# EAGLE design honeybee (EAGLE 7.6.0)
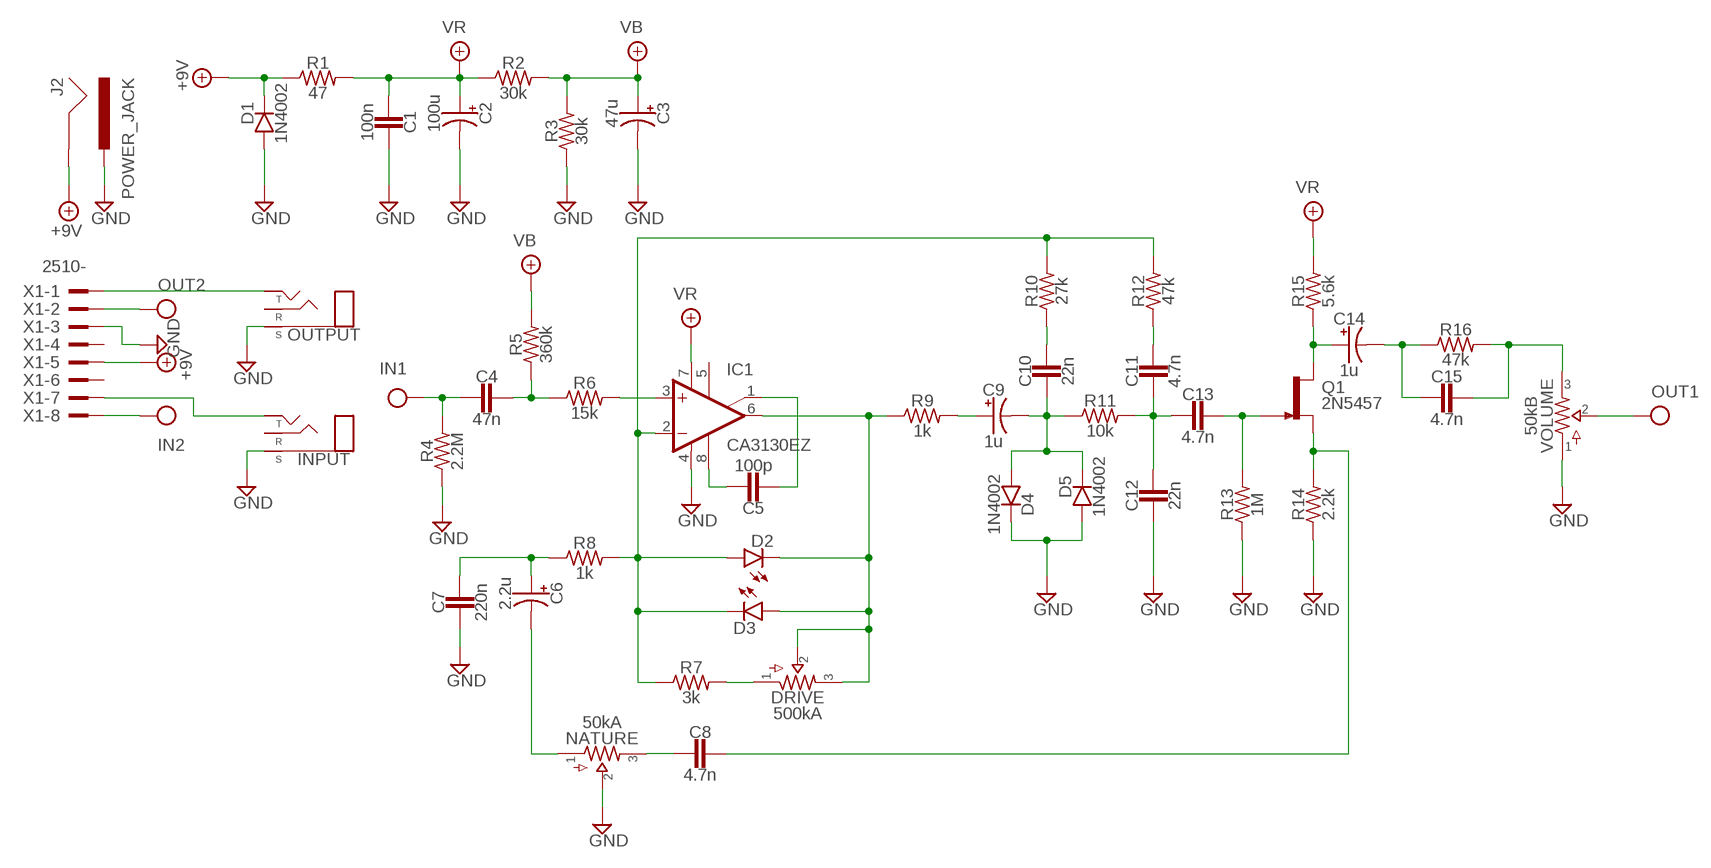
[diagram p0: schematic, sheet 1]

## Parts
C1  100n  CER/FILM2  [050X030_025_2]
C2  100u  0400  [040_020]
C3  47u  0400  [040_020]
C4  47n  CER/FILMBOX.1  [BOX_SMALL]
C5  100p  CER/FILM2  [050X030_025_2]
C6  2.2u  0500  [050_020]
C7  220n  CER/FILMBOX.1  [BOX_SMALL]
C8  4.7n  CER/FILMBOX.1  [BOX_SMALL]
C9  1u  0400  [040_020]
C10  22n  CER/FILMBOX.1  [BOX_SMALL]
C11  4.7n  CER/FILMBOX.1  [BOX_SMALL]
C12  22n  CER/FILMBOX.1  [BOX_SMALL]
C13  4.7n  CER/FILMBOX.1  [BOX_SMALL]
C14  1u  0400  [040_020]
C15  4.7n  CER/FILMBOX.1  [BOX_SMALL]
D1  1N4002  DO41.2  [DO41-2]
D2  LED  [3MM_D]
D3  LED  [3MM_D]
D4  1N4002  DO41.2  [DO41-2]
D5  1N4002  DO41.2  [DO41-2]
DRIVE  500kA  POTS16MM  [16MM]
IC1  CA3130EZ  CA3130N  [DIL08]
INPUT  STEREONMJ  [NMJ6HCD2]
J2  POWER_JACK  [POWER_JACK_PTH]
NATURE  50kA  POTS16MM  [16MM]
OUTPUT  STEREONMJ  [NMJ6HCD2]
Q1  2N5457  [TO92-]
R1  47  R_.3B  [R0207/3]
R2  30k  R_.3B  [R0207/3]
R3  30k  R_.3B  [R0207/3]
R4  2.2M  R_.3B  [R0207/3]
R5  360k  R_.3B  [R0207/3]
R6  15k  R_.3B  [R0207/3]
R7  3k  R_.3B  [R0207/3]
R8  1k  R_.3B  [R0207/3]
R9  1k  R_.3B  [R0207/3]
R10  27k  R_.3B  [R0207/3]
R11  10k  R_.3B  [R0207/3]
R12  47k  R_.3B  [R0207/3]
R13  1M  R_.3B  [R0207/3]
R14  2.2k  R_.3B  [R0207/3]
R15  5.6k  R_.3B  [R0207/3]
R16  47k  R_.3B  [R0207/3]
VOLUME  50kB  POTS16MM  [16MM]
X1  2510-  [PAK100/2500-10]

## Nets
+18V: D1.C J2.GND R1.1 X1.5 ; supply symbol labelled +9V
GND: C1.1 C2.- C3.- C7.2 C12.2 D1.A D4.C D5.A IC1.4(V-) INPUT.S J2.PWR NATURE.2 OUTPUT.S R3.1 R4.1 R13.1 R14.1 VOLUME.1 X1.3
IN: C4.2 R4.2 X1.8
N$1: C5.1 IC1.8(CMP)
N$2: C5.2 IC1.1(ON/CMP)
N$3: IC1.3(+IN) R6.2
N$4: C4.1 R5.1 R6.1
N$5: D2.ANODE(A) D3.P$1(C) IC1.2(-IN) R7.1 R8.2 R10.2 R12.2
N$6: DRIVE.1 R7.2
N$7: D2.P$1(C) D3.ANODE(A) DRIVE.2 DRIVE.3 IC1.6(OUT) R9.1
N$8: C6.+ C7.1 R8.1
N$9: C6.- NATURE.1
N$10: C8.2 NATURE.3
N$11: C9.- C10.2 D4.A D5.C R11.1
N$12: C13.1 Q1.1(G) R13.2
N$13: C9.+ R9.2
N$14: C11.2 C12.1 C13.2 R11.2
N$15: C11.1 R12.1
N$16: C10.1 R10.1
N$17: C8.1 Q1.2(S) R14.2
N$19: C14.+ Q1.3(D) R15.1
N$20: C14.- C15.2 R16.1
N$21: C15.1 R16.2 VOLUME.3
N$35: OUTPUT.T X1.1
N$36: INPUT.T X1.7
OUT: VOLUME.2 X1.2
VB: C3.+ R2.2 R3.2 R5.2
VR: C1.2 C2.+ IC1.7(V+) R1.2 R2.1 R15.2
Unconnected: IC1.5(ON) INPUT.R OUTPUT.R X1.4 X1.6

## Library data of the parts
C1 C4 C5 C7 C8 C10-C13 C15 = pedals-capacitors-film:CER/FILM: 47 - 120pF Xicon Ceramic Disc 2.5mm lead spacing
C2 C3 C9 C14 = pedals-capacitors-elec:040
C6 = pedals-capacitors-elec:050
D1 D4 D5 = pedals-diodes:DO41: DO-41 Package Diodes: 1N4001 - 1N40019 Zener Diodes: 1N4728 - 1N4764
D2 D3 = pedals-diodes:LED
DRIVE NATURE VOLUME = pedals-potentiometers:POTS
IC1 = pedals-integrated circuits:CA3130: OP AMP
INPUT OUTPUT = pedals-jacks:STEREO
J2 = pedals-jacks:POWER_JACK: Power Jack Connector This is the standard 5.5mm barrel jack for power. The PTH is the most common, proven, reliable, footprint. The Slot footprint only works if the mill layer is transmitted to the PCB fab house so be warned. Here are the connectors we sell at SparkFun: DC Barrel Power Jack/Connector <https://www.sparkfun.com/products/119> (PRT-00119) DC Barrel Power Jack/Connector (SMD) <https://www.sparkfun.com/products/12748> (PRT-12748) DC Barrel Jack Adapter - Breadboard Compatible <https://www.sparkfun.com/products/10811> (PRT-10811) It is used on this SparkFun product (and many, many others): SparkFun RedBoard - Programmed with Arduino <https://www.sparkfun.com/products/12757> (DEV-12757) Also, if you need a mating power supply or connector, please check these out: Wall Adapter Power Supply - 9VDC 650mA <https://www.sparkfun.com/products/298> (TOL-00298) DC Barrel Jack Adapter - Male <https://www.sparkfun.com/products/10287> (PRT-10287); PROD_ID: CONN-08197
Q1 = pedals-transistors:2N5457: N-CHANNEL JFET
R1-R16 = pedals-resistors:R_
X1 = pedals-headers:2510-: 3M (TM) Pak 100 4-Wall Header Source: 3M; MF: 3M; MPN: 2510-6002UB; OC_FARNELL: 9838244; OC_NEWARK: 46F4725

## Board
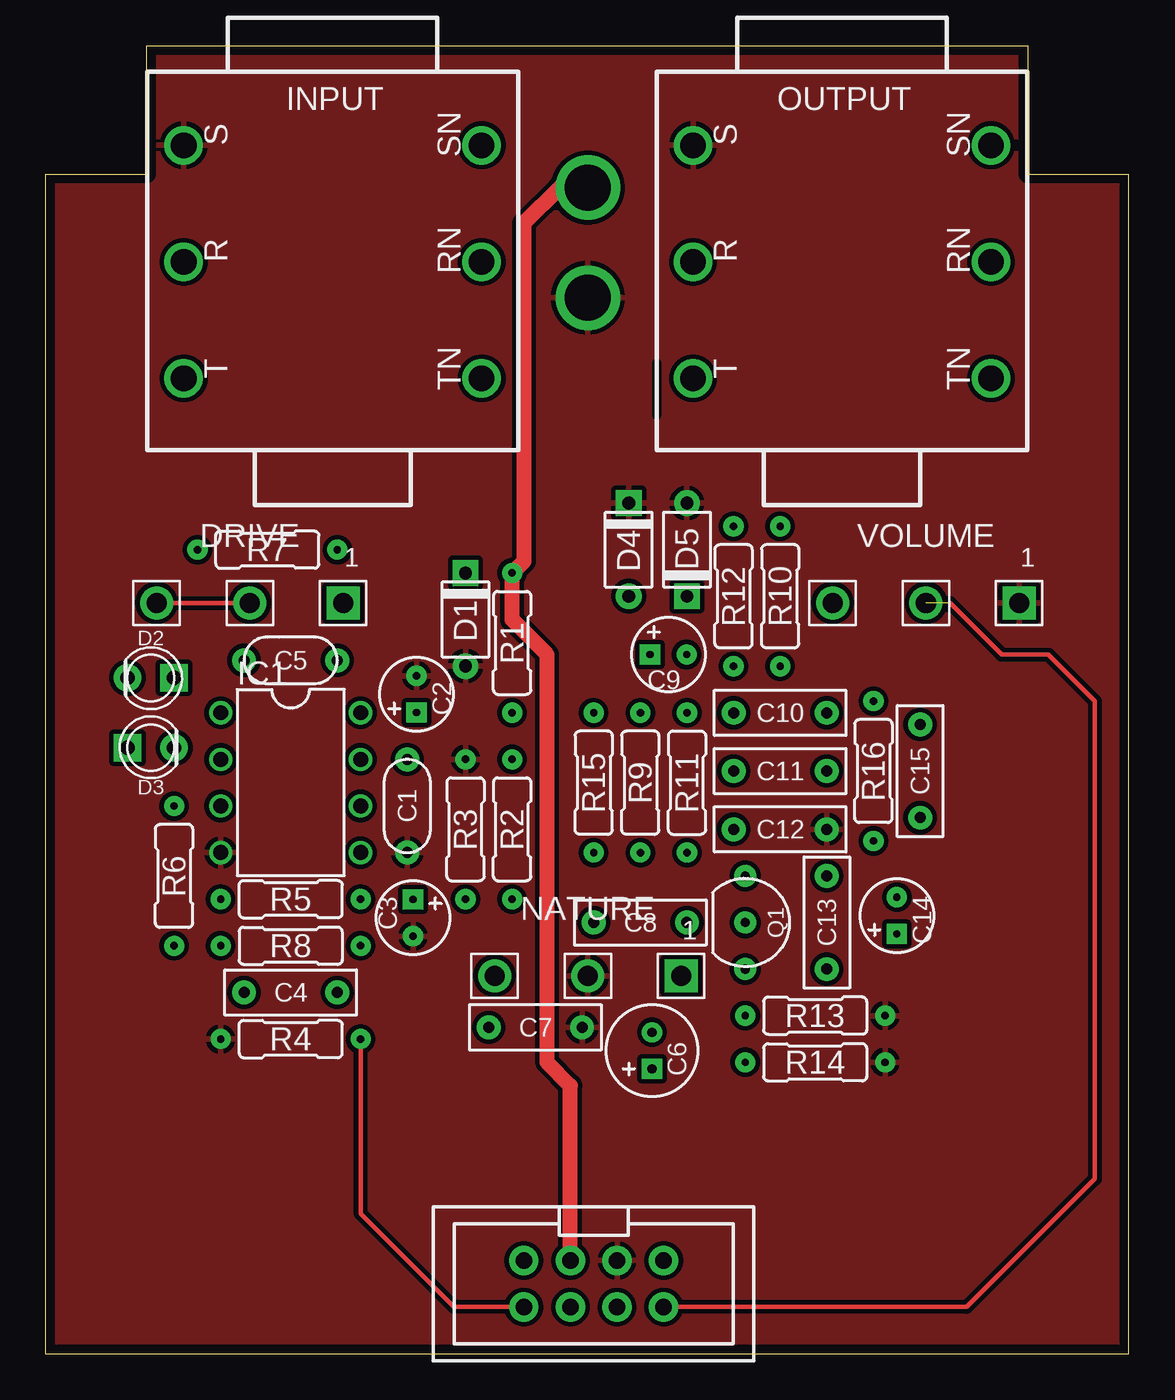
[diagram p1: board, top side]
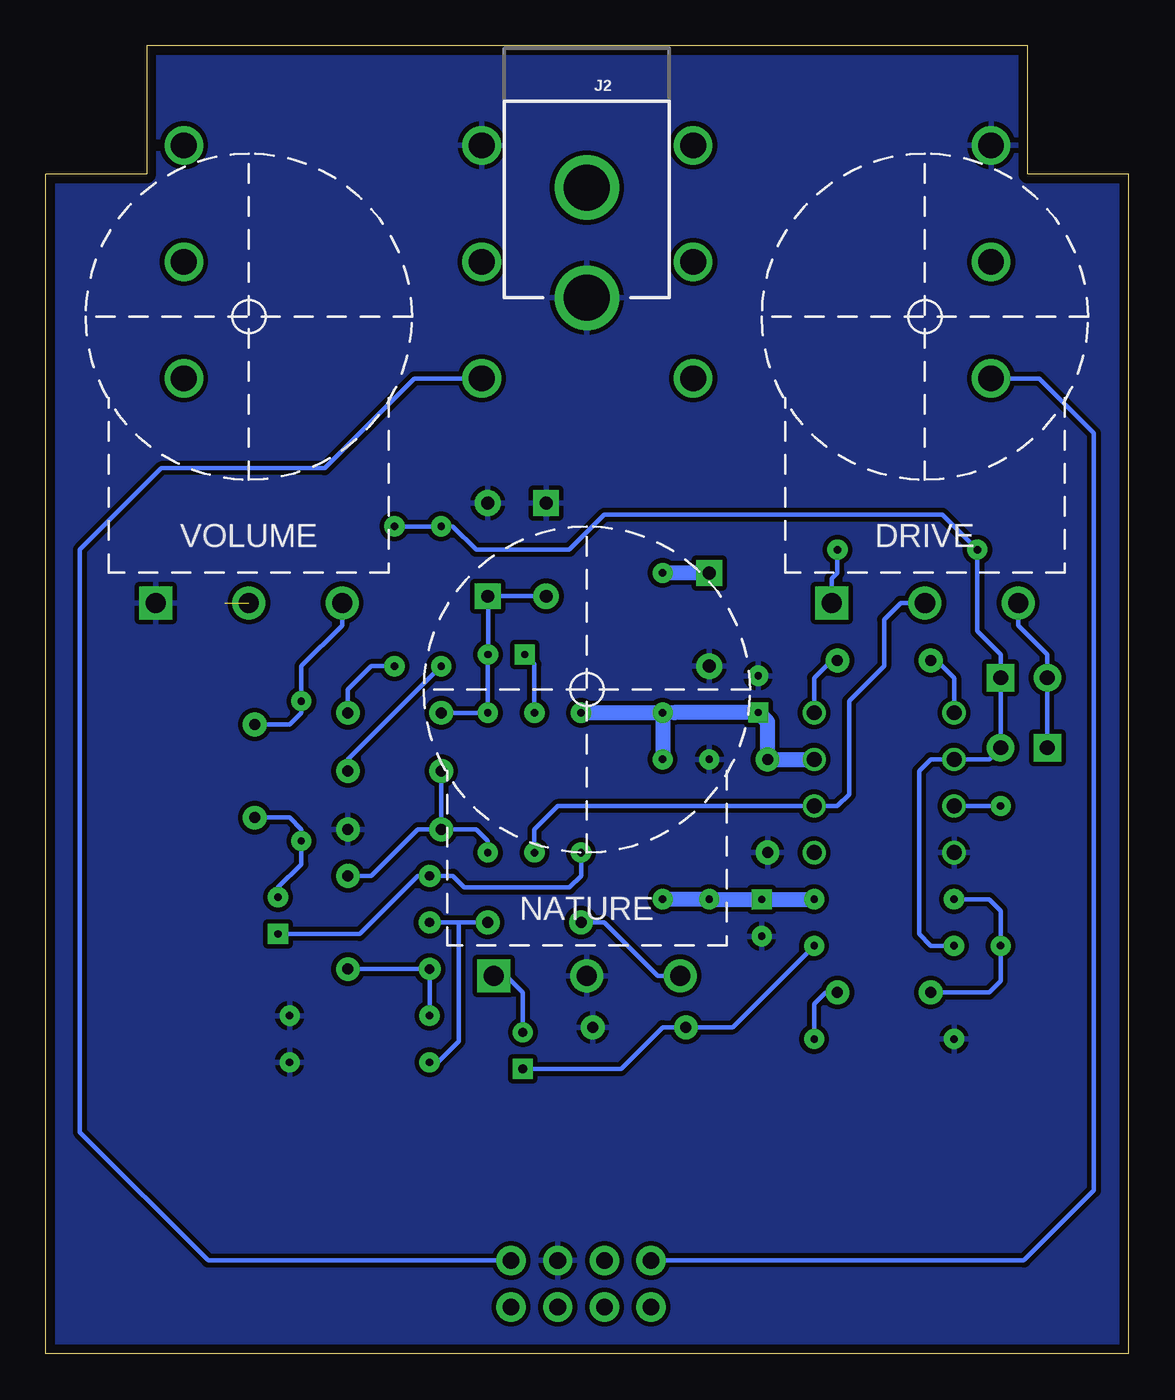
[diagram p2: board, bottom side, seen from below]

Size 59 x 71.27 mm. Coordinates in mm from the lower left corner, seen from the top.
Copper layers (1*16): Top 0.035mm / dielectric 1.6mm / Bottom 0.035mm
Design rules "Elecrow_2-layer_PCB_eagle_rule": minimum track width 6mil, minimum drill 12mil, track to track 6mil, track to pad 6mil, pad to pad 6mil, via to via 8mil, smd to smd 0mil, copper to edge 20mil, drill to drill 10mil, minimum pad ring 6mil, minimum via ring 6mil, stop-mask expansion 0mil, vias tented up to drill 100mil, thermal gap 10mil
tRestrict: 1 lines

### Footprints (pad centres in the part's own frame; a part is rotated, then mirrored left to right if it is on the bottom)
050X030_025_2 = drill 0.6 pad 1.3: 1 -2.54,0; 2 2.54,0
040_020 = drill 0.4 pad 1.1 square: + -1.001,0 | drill 0.4 pad 1.1: - 1.001,0
BOX_SMALL = drill 0.6 pad 1.3: 1 -2.54,0; 2 2.54,0
050_020 = drill 0.5 pad 1.1 square: + -0.998,0.001 | drill 0.5 pad 1.1: - 0.998,0.001
DO41-2 = drill 0.7 pad 1.4: A 2.54,0 | drill 0.7 pad 1.4 square: C -2.54,0
3MM_D = drill 0.8 pad 1.5 square: ANODE -1.27,0 | drill 0.8 pad 1.5: P$1 1.27,0
16MM = drill 1.1 pad 1.8 square: 1 5.08,-1 | drill 1.1 pad 1.8: 2 0,-1; 3 -5.08,-1
DIL08 = drill 0.813 pad 1.27: 1 -3.81,-3.81; 2 -1.27,-3.81; 3 1.27,-3.81; 4 3.81,-3.81; 5 3.81,3.81; 6 1.27,3.81; 7 -1.27,3.81; 8 -3.81,3.81
NMJ6HCD2 = drill 1.4: R 0,8.115; RN 0,-8.115; S 6.35,8.115; SN 6.35,-8.115; T -6.35,8.115; TN -6.35,-8.115
POWER_JACK_PTH = drill 2.5: GND 0,7.7; PWR 0,13.7
TO92- = drill 0.5 pad 1.2: 1 2.54,0; 2 0,0; 3 -2.54,0
R0207/3 = drill 0.4 pad 1.1: 1 -3.81,0; 2 3.81,0
PAK100/2500-10 = drill 0.9 pad 1.6: 1 -3.81,-1.27; 2 -3.81,1.27; 3 -1.27,-1.27; 4 -1.27,1.27; 5 1.27,-1.27; 6 1.27,1.27; 7 3.81,-1.27; 8 3.81,1.27

### Placement (x,y rotation side)
C1  19.68,29.84 90 top
C2  20.19,35.94 90 top
C3  20,23.75 270 top
C4  13.33,19.68 0 top
C5  13.33,37.78 180 top
C6  33.02,16.51 90 top
C7  26.67,17.78 0 top
C8  32.38,23.5 180 top
C9  33.91,38.1 0 top
C10  40,34.92 180 top
C11  40,31.75 180 top
C12  40,28.57 0 top
C13  42.54,23.5 90 top
C14  46.35,23.88 90 top
C15  47.62,31.75 270 top
D1  22.86,40.01 270 top
D2  5.71,36.83 180 top
D3  5.71,33.02 0 top
D4  31.75,43.81 270 top
D5  34.92,43.81 90 top
DRIVE  11.11,41.91 0 top
IC1  13.33,31.11 270 top
INPUT  15.62,59.5 90 top
J2  29.53,71.25 180 bottom
NATURE  29.53,21.59 0 top
OUTPUT  43.37,59.5 90 top
Q1  38.1,23.5 270 top
R1  25.4,38.73 270 top
R2  25.4,28.57 270 top
R3  22.86,28.57 270 top
R4  13.33,17.14 0 top
R5  13.33,24.77 0 top
R6  6.98,26.04 90 top
R7  12.06,43.81 0 top
R8  13.33,22.23 180 top
R9  32.38,31.11 90 top
R10  40,41.27 90 top
R11  34.92,31.11 270 top
R12  37.46,41.27 90 top
R13  41.91,18.41 180 top
R14  41.91,15.88 180 top
R15  29.84,31.11 90 top
R16  45.08,31.75 90 top
U$1  [125B_PCB]  0,1.27 0 top
VOLUME  47.94,41.91 0 top
X1  29.84,3.81 180 top

### Tracks (layer width: path | path; a pad name or v marks a point on that pad's centre or on a via)
+18V
  Top 0.813: J2.GND 27.99,63.55 26.03,61.59 26.03,43.18 R1.1 25.4,40.01 27.3,38.1 27.3,15.88 28.57,14.61 X1.5
  Bottom 0.813: D1.C R1.1
GND
  pour Bottom (isolate 0.254): 0,64.14 0,0 59.06,0.64 59.06,64.77 53.34,64.14 53.34,71.12 5.71,71.12 5.71,64.14
  pour Top (isolate 0.254): 0,0 59.06,0 59.06,71.12 0,71.12
IN
  Top 0.254: X1.8 22.22,2.54 17.14,7.62 R4.2
  Bottom 0.254: R4.2 17.14,19.05 16.51,19.68 C4.2
N$1
  Bottom 0.254: C5.1 16.19,37.78 17.14,36.83 IC1.8
N$2
  Bottom 0.254: C5.2 10.48,37.78 9.52,36.83 IC1.1
N$3
  Bottom 0.254: IC1.3 R6.2
N$4
  Bottom 0.254: C4.1 7.62,19.68 6.98,20.32 R6.1 6.98,24.13 7.62,24.77 R5.1
N$5
  Bottom 0.254: R8.2 10.79,22.23 11.43,22.86 11.43,31.75 10.79,32.38 IC1.2 7.62,32.38 D3.P$1 D2.ANODE 6.98,38.1 8.25,39.37 R7.1 10.16,45.72 28.57,45.72 30.48,43.81 35.56,43.81 36.83,45.09 R12.2 R10.2
N$6
  Bottom 0.254: DRIVE.1 16.19,42.23 15.88,42.55 R7.2
N$7
  Top 0.254: DRIVE.3 DRIVE.2
  Bottom 0.254: DRIVE.2 12.43,40.91 13.33,40.01 13.33,37.47 15.24,35.56 15.24,30.48 15.88,29.84 IC1.6 31.11,29.84 32.38,28.57 R9.1 | D3.ANODE D2.P$1 4.44,38.1 6.03,39.69 DRIVE.3
N$8
  Bottom 0.254: R8.1 21.59,17.78 C7.1 25.4,17.78 27.67,15.51 C6.+
N$9
  Bottom 0.254: NATURE.1 33.92,20.59 33.02,19.68 33.02,18.14 C6.-
N$10
  Bottom 0.254: NATURE.3 25.67,20.59 28.57,23.5 C8.2
N$11
  Bottom 0.254: C10.2 R11.1 34.92,38.09 C9.- 34.91,41.26 D5.C D4.A
N$12
  Bottom 0.254: C13.1 Q1.1 R13.2
N$13
  Bottom 0.254: R9.2 32.38,37.58 C9.+
N$14
  Bottom 0.254: R11.2 34.92,27.94 35.56,28.57 C12.1 | C11.2 C12.1 | C12.1 38.73,28.57 41.27,26.04 C13.2
N$15
  Bottom 0.254: R12.1 42.54,32.38 C11.1
N$16
  Bottom 0.254: R10.1 41.27,37.47 42.54,36.2 C10.1
N$17
  Bottom 0.254: C8.1 36.45,23.5 | 36.45,23.5 Q1.2 | R14.2 37.65,15.88 36.51,17.02 36.51,23.37 36.45,23.5
N$19
  Bottom 0.254: R15.1 29.84,26.04 30.48,25.4 36.19,25.4 36.83,26.04 Q1.3 38.73,26.04 41.91,22.86 46.34,22.86 C14.+
N$20
  Bottom 0.254: C14.- 46.35,25.4 45.08,26.67 R16.1 45.08,28.57 45.72,29.21 C15.2
N$21
  Bottom 0.254: VOLUME.3 42.86,39.69 45.08,37.47 R16.2 45.08,34.92 45.72,34.29 C15.1
N$35
  Bottom 0.254: X1.1 50.16,5.08 57.15,12.06 57.15,43.81 52.7,48.26 43.81,48.26 38.93,53.15 OUTPUT.T
N$36
  Bottom 0.254: X1.7 5.71,5.08 1.9,8.89 1.9,50.16 4.89,53.15 INPUT.T
OUT  (1 unrouted)
  Top 0.254: 49.26,40.91 52.07,38.1 54.61,38.1 57.15,35.56 57.15,9.53 50.16,2.54 X1.2
VB
  Bottom 0.813: R2.2 R3.2 20.02,24.77 C3.+ 17.16,24.75 R5.2
VR
  Bottom 0.813: IC1.7 C1.2 19.68,34.43 C2.+ 24.75,34.94 R1.2 | R1.2 R2.1 | R1.2 R15.2